# Altium project Telemetry_board.PrjPCB
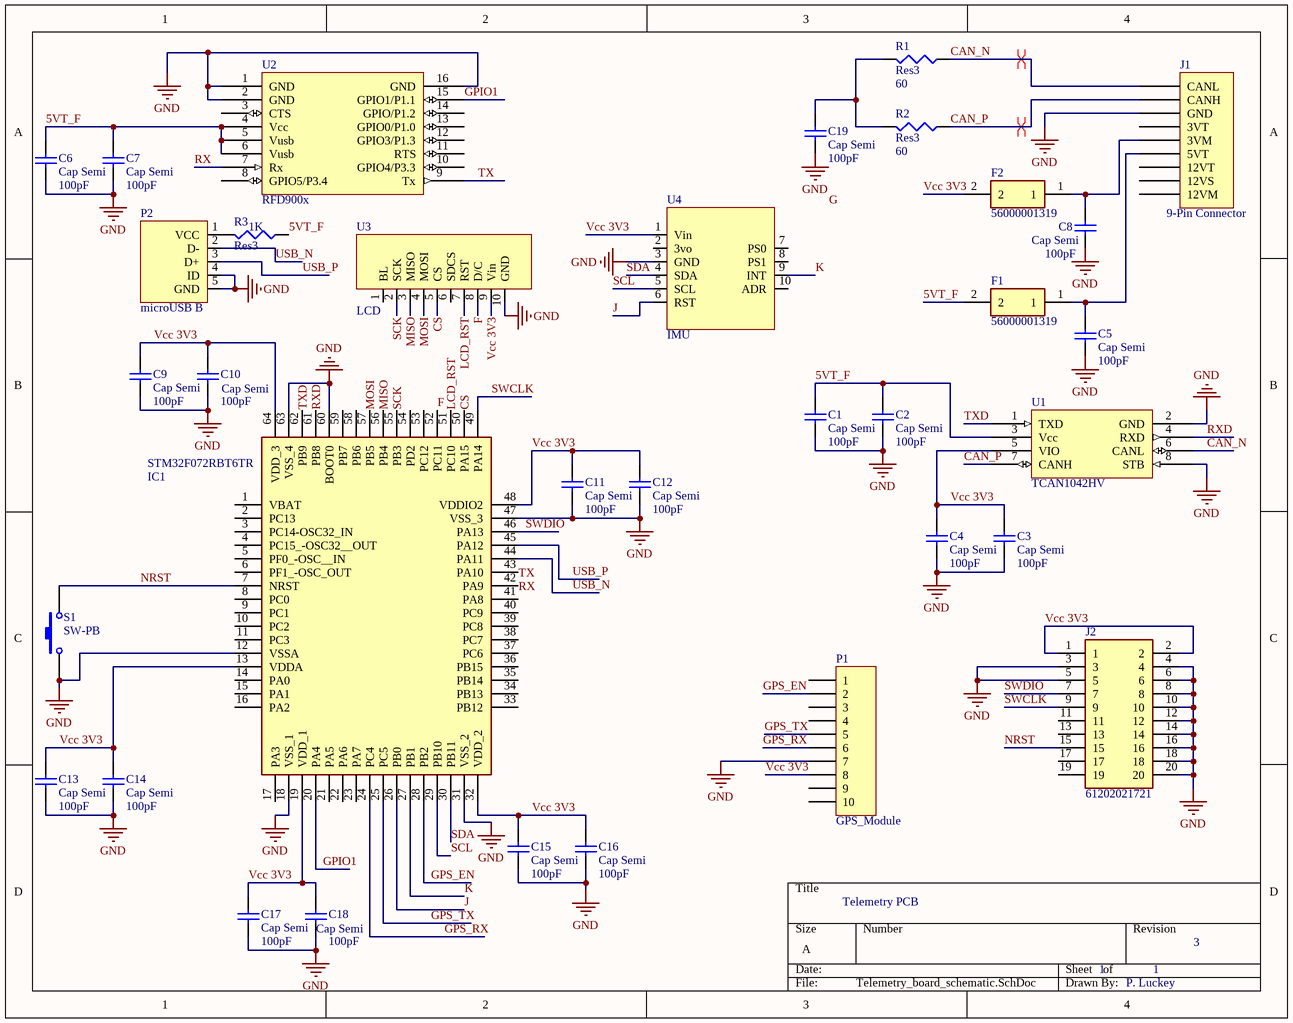
[diagram p0: Telemetry_board_schematic.SchDoc]
1 sheet, 34 parts. Net scope: global (net labels, ports and power ports of the same name join across sheets).
Board file: Telemetry_board_pcb.PcbDoc

## Sheet Telemetry_board_schematic.SchDoc
size A

### Parts
C1  Cap Semi  value 100pF  [C1206]
C2  Cap Semi  value 100pF  [C1206]
C3  Cap Semi  value 100pF  [C1206]
C4  Cap Semi  value 100pF  [C1206]
C5  Cap Semi  value 100pF  [C1206]
C6  Cap Semi  value 100pF  [C1206]
C7  Cap Semi  value 100pF  [C1206]
C8  Cap Semi  value 100pF  [C1206]
C9  Cap Semi  value 100pF  [C1206]
C10  Cap Semi  value 100pF  [C1206]
C11  Cap Semi  value 100pF  [C1206]
C12  Cap Semi  value 100pF  [C1206]
C13  Cap Semi  value 100pF  [C1206]
C14  Cap Semi  value 100pF  [C1206]
C15  Cap Semi  value 100pF  [C1206]
C16  Cap Semi  value 100pF  [C1206]
C17  Cap Semi  value 100pF  [C1206]
C18  Cap Semi  value 100pF  [C1206]
C19  Cap Semi  value 100pF  [C1206]
F1  56000001319  [56000001319]
F2  56000001319  [56000001319]
IC1  STM32F072RBT6TR  [STM32F072 64-pin]
J1  9-Pin Connector  [9-Pin]
J2  61202021721  [ST-Link Header]
P1  GPS_Module  [HDR1X10]
P2  microUSB B  [microUSB B]
R1  Res3  value 60  [J1-0603]
R2  Res3  value 60  [J1-0603]
R3  Res3  value 1K  [J1-0603]
S1  SW-PB  [SPST-2]
U1  TCAN1042HV  [CANIC]
U2  RFD900x  [RFD900X_w_conn]
U3  LCD  [LCD]
U4  IMU  [IMU]

### Nets
GND: C1.2 C2.2 C3.2 C4.2 C5.1 C6.2 C7.2 C8.1 C9.2 C10.2 C11.2 C12.2 C13.2 C14.2 C15.2 C16.2 C17.2 C18.2 C19.2 IC1.12(VSSA) IC1.18(VSS_1) IC1.31(VSS_2) IC1.47(VSS_3) IC1.60(BOOT0) IC1.63(VSS_4) J1.7(GND) J2.3 J2.4 J2.5 J2.6 J2.8 J2.10 J2.12 J2.14 J2.16 J2.18 J2.20 P1.7 P2.4(ID) P2.5(GND) S1.1 U1.2(GND) U1.8(STB) U2.1(GND) U2.2(GND) U2.16(GND) U3.10(GND) U4.3(GND)
5VT_F: C1.1 C2.1 C6.1 C7.1 F1.2 R3.1 U1.3(Vcc) U2.4(Vcc) U2.5(Vusb) U2.6(Vusb)
CAN_N: J1.9(CANL) R1.1 U1.6(CANL)
CAN_P: J1.8(CANH) R2.1 U1.7(CANH)
CS: IC1.50(PA15) U3.5(CS)
F: IC1.52(PC11) U3.8(D/C)
GPIO1: IC1.20(PA4) U2.15(GPIO1/P1.1)
GPS_EN: IC1.28(PB2) P1.2
GPS_RX: IC1.24(PC4) P1.6
GPS_TX: IC1.25(PC5) P1.5
J: IC1.26(PB0) U4.6(RST)
K: IC1.27(PB1) U4.9(INT)
LCD_RST: IC1.51(PC10) U3.7(RST)
MISO: IC1.56(PB4) U3.3(MISO)
MOSI: IC1.57(PB5) U3.4(MOSI)
NRST: IC1.7(NRST) J2.15 S1.2
RX: IC1.42(PA9) U2.7(Rx)
RXD: IC1.61(PB8) U1.4(RXD)
SCK: IC1.55(PB3) U3.2(SCK)
SCL: IC1.29(PB10) U4.5(SCL)
SDA: IC1.30(PB11) U4.4(SDA)
SWCLK: IC1.49(PA14) J2.9
SWDIO: IC1.46(PA13) J2.7
TX: IC1.43(PA10) U2.9(Tx)
TXD: IC1.62(PB9) U1.1(TXD)
USB_N: IC1.44(PA11) P2.2(D-)
USB_P: IC1.45(PA12) P2.3(D+)
Vcc 3V3: C3.1 C4.1 C9.1 C10.1 C11.1 C12.1 C13.1 C14.1 C15.1 C16.1 C17.1 C18.1 F2.2 IC1.13(VDDA) IC1.19(VDD_1) IC1.32(VDD_2) IC1.48(VDDIO2) IC1.64(VDD_3) J2.1 J2.2 P1.8 U1.5(VIO) U3.9(Vin) U4.1(Vin)
NetC5_2: C5.2 F1.1 J1.4(5VT)
NetC8_2: C8.2 F2.1 J1.5(3VM)
NetC19_1: C19.1 R1.2 R2.2
NetP2_1: P2.1(VCC) R3.2

Not connected (* = marked no-connect by the designer): IC1 1(VBAT) 2(PC13) 3(PC14-OSC32_IN) 4(PC15_-OSC32__OUT) 5(PF0_-OSC__IN) 6(PF1_-OSC_OUT) 8(PC0) 9(PC1) 10(PC2) 11(PC3) 14(PA0) 15(PA1) 16(PA2) 17(PA3) 21(PA5) 22(PA6) 23(PA7) 33(PB12) 34(PB13) 35(PB14) 36(PB15) 37(PC6) 38(PC7) 39(PC8) 40(PC9) 41(PA8) 53(PC12) 54(PD2) 58(PB6) 59(PB7); J1 1(12VM) 2(12VS) 3(12VT) 6(3VT); J2 11 13 17 19; P1 1 3 4 9 10; U2 3(CTS) 8(GPIO5/P3.4) 10(GPIO4/P3.3) 11(RTS) 12(GPIO3/P1.3) 13(GPIO0/P1.0) 14(GPIO/P1.2); U3 1(BL) 6(SDCS); U4 2(3vo) 7(PS0) 8(PS1) 10(ADR)

### Layout directives
differential pair: CAN_N, CAN_P

### Notes on the sheet
- Telemetry PCB
- 1
- 3
- P. Luckey
- Labels drawn without touching a wire or pin: G

### Library data of the parts
C1-C19 = Cap Semi: Capacitor (Semiconductor SIM Model); Published: 8-Jun-2000; LatestRevisionDate: 29-May-2009; LatestRevisionNote: IPC-7351 Footprint Added.; PackageReference: C1206; Publisher: Altium Limited; PackageDescription: Chip Capacitor
F1 F2 = 56000001319: Fuse; Manufacturer_Name: LITTELFUSE; Datasheet Link: https://componentsearchengine.com/Datasheets/1/56000001319.pdf; Height: 4.3mm; Mouser Part Number: 576-56000001319; Mouser Price/Stock: https://www.mouser.com/Search/Refine.aspx?Keyword=576-56000001319; Manufacturer_Part_Number: 56000001319
IC1 = STM32F072RBT6TR: Integrated Circuit; Manufacturer_Name: STMicroelectronics; Datasheet Link: https://componentsearchengine.com/Datasheets/1/STM32F072RBT6TR.pdf; Height: 1.6mm; Mouser Part Number: 511-STM32F072RBT6TR; Mouser Price/Stock: https://www.mouser.com/Search/Refine.aspx?Keyword=511-STM32F072RBT6TR; Manufacturer_Part_Number: STM32F072RBT6TR
J2 = 61202021721: Wurth Elektronic 20 pin connector Programmar; Manufacturer_Name: Wurth Elektronik; Datasheet Link: https://componentsearchengine.com/Datasheets/1/61202021721.pdf; Height: 9.25mm; Mouser Part Number: 710-61202021721; Mouser Price/Stock: https://www.mouser.com/Search/Refine.aspx?Keyword=710-61202021721; Manufacturer_Part_Number: 61202021721
P1 = Header 10: Header, 10-Pin; LatestRevisionDate: 17-Jul-2002; LatestRevisionNote: Re-released for DXP Platform.; Publisher: Altium Limited
R1-R3 = Res3: Resistor; Published: 8-Jun-2000; LatestRevisionDate: 29-May-2009; LatestRevisionNote: IPC-7351 Footprint Added.; PackageReference: J1-0603; Publisher: Altium Limited; PackageDescription: Chip Resistor
S1 = SW-PB: Switch; Published: 24-Mar-1999; LatestRevisionDate: 17-Jul-2002; LatestRevisionNote: Re-released for DXP Platform.; PackageReference: SPST-2; Publisher: Altium Limited; PackageDescription: Switch; 2 Leads
U1 = TCAN1042HV: TCAN1042Fault ProtectedCAN Transceiverwith CAN FD; ComponentLink1Description: Datasheet; ComponentLink1URL: http://www.ti.com/lit/ds/symlink/tcan1042hgv.pdf
U2 = RFD900x: RF Modem; ComponentLink1Description: Datasheet Library; ComponentLink1URL: https://files.rfdesign.com.au/docs/; ComponentLink2Description: Connector; ComponentLink2URL: https://s3.amazonaws.com/catalogspreads-pdf/PAGE123%20.100%20SFH11%20SERIES%20FEMALE%20HDR%20ST%20RA.pdf